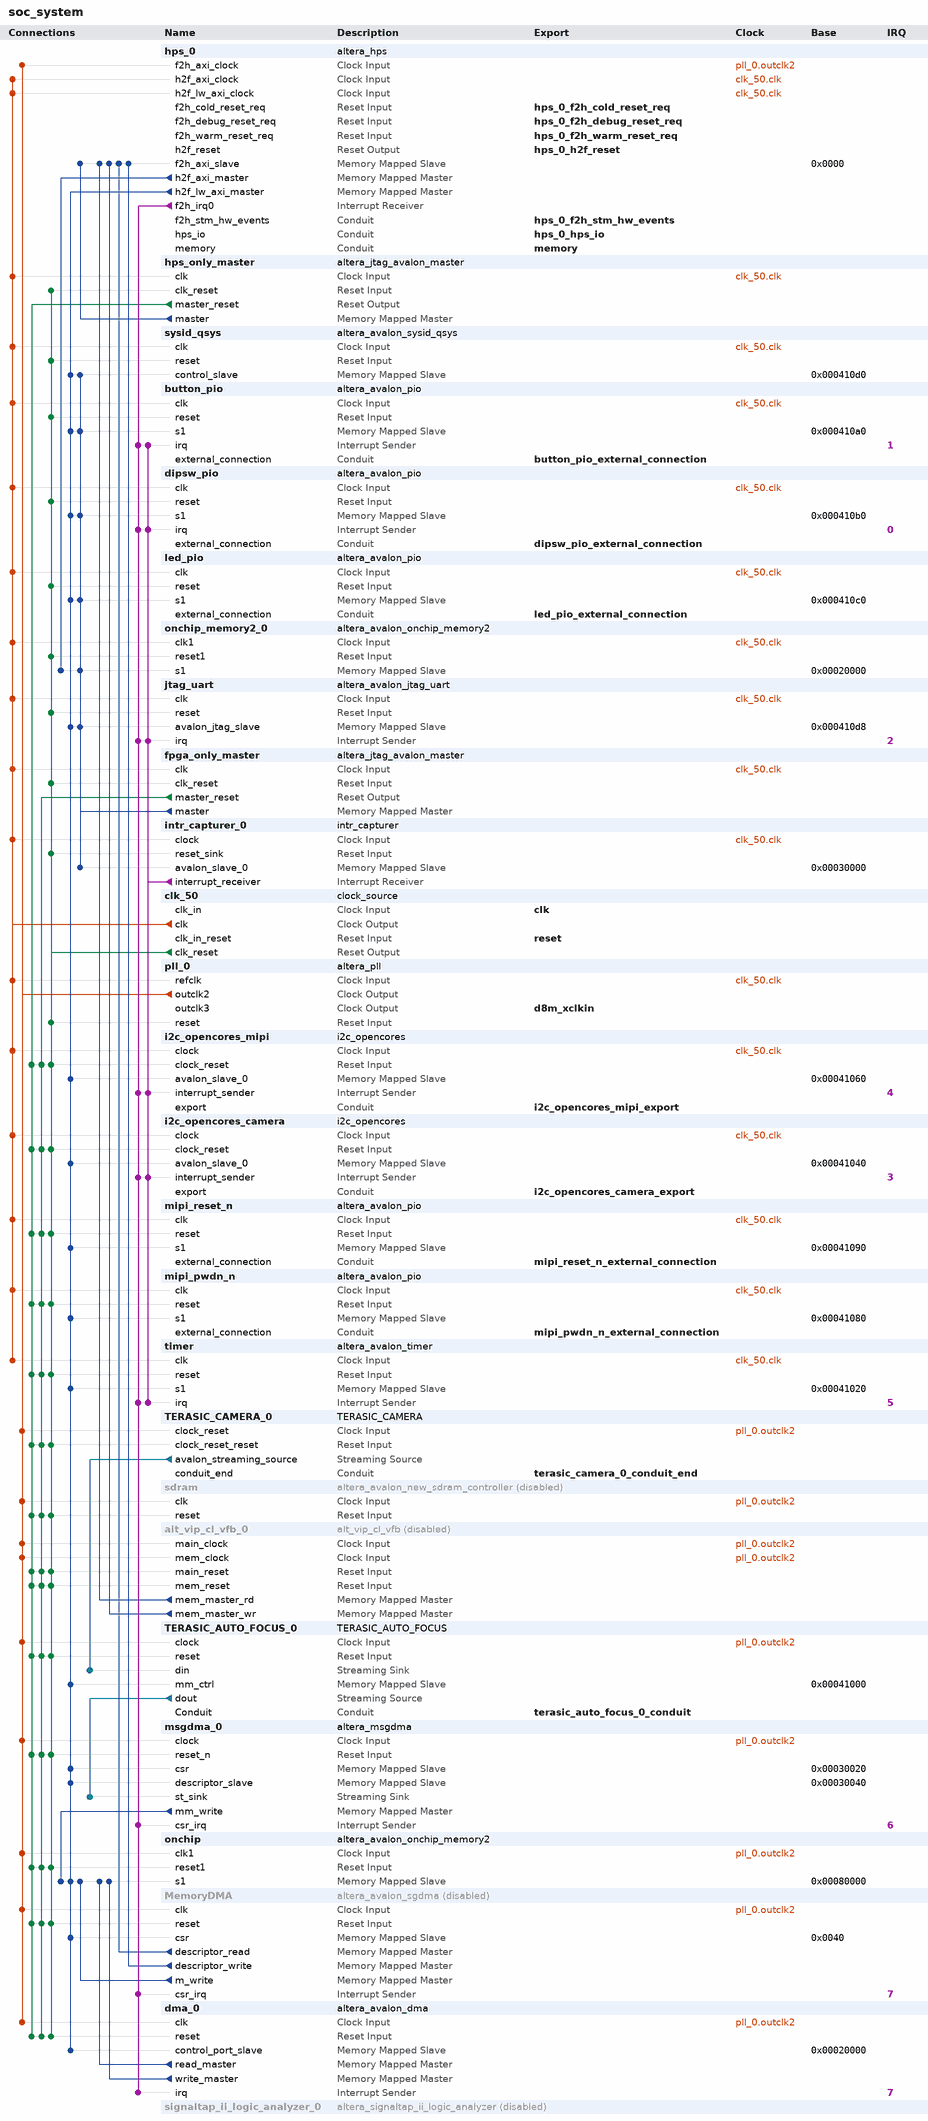
[diagram p0: system contents]
# Platform Designer (Qsys) system soc_system, Cyclone V 5CSEMA4U23C6
# Parameters at their usual value, and those the tool derives, are not listed.
package require -exact qsys 18.0
create_system soc_system
set_project_property DEVICE_FAMILY {Cyclone V}
set_project_property DEVICE 5CSEMA4U23C6

add_instance hps_0 altera_hps 18.0
set_instance_parameter_value hps_0 EMAC1_Mode RGMII
set_instance_parameter_value hps_0 EMAC1_PinMuxing {HPS I/O Set 0}
set_instance_parameter_value hps_0 F2SCLK_COLDRST_Enable true
set_instance_parameter_value hps_0 F2SCLK_DBGRST_Enable true
set_instance_parameter_value hps_0 F2SCLK_WARMRST_Enable true
set_instance_parameter_value hps_0 F2SINTERRUPT_Enable true
set_instance_parameter_value hps_0 F2S_Width 1
set_instance_parameter_value hps_0 FPGA_PERIPHERAL_OUTPUT_CLOCK_FREQ_EMAC0_GTX_CLK 100
set_instance_parameter_value hps_0 FPGA_PERIPHERAL_OUTPUT_CLOCK_FREQ_EMAC0_MD_CLK 100.0
set_instance_parameter_value hps_0 FPGA_PERIPHERAL_OUTPUT_CLOCK_FREQ_EMAC1_GTX_CLK 100
set_instance_parameter_value hps_0 FPGA_PERIPHERAL_OUTPUT_CLOCK_FREQ_EMAC1_MD_CLK 100.0
set_instance_parameter_value hps_0 HPS_PROTOCOL DDR3
set_instance_parameter_value hps_0 I2C0_Mode I2C
set_instance_parameter_value hps_0 I2C0_PinMuxing {HPS I/O Set 0}
set_instance_parameter_value hps_0 I2C1_Mode I2C
set_instance_parameter_value hps_0 I2C1_PinMuxing {HPS I/O Set 0}
set_instance_parameter_value hps_0 LWH2F_Enable true
set_instance_parameter_value hps_0 MEM_BANKADDR_WIDTH 3
set_instance_parameter_value hps_0 MEM_CLK_FREQ 400.0
set_instance_parameter_value hps_0 MEM_COL_ADDR_WIDTH 10
set_instance_parameter_value hps_0 MEM_DQ_WIDTH 32
set_instance_parameter_value hps_0 MEM_DRV_STR RZQ/6
set_instance_parameter_value hps_0 MEM_ROW_ADDR_WIDTH 13
set_instance_parameter_value hps_0 MEM_RTT_NOM RZQ/6
set_instance_parameter_value hps_0 MEM_RTT_WR {Dynamic ODT off}
set_instance_parameter_value hps_0 MEM_TCL 7
set_instance_parameter_value hps_0 MEM_TFAW_NS 37.5
set_instance_parameter_value hps_0 MEM_TRAS_NS 35.0
set_instance_parameter_value hps_0 MEM_TRCD_NS 13.75
set_instance_parameter_value hps_0 MEM_TRFC_NS 300.0
set_instance_parameter_value hps_0 MEM_TRP_NS 13.75
set_instance_parameter_value hps_0 MEM_VENDOR Other
set_instance_parameter_value hps_0 MEM_WTCL 7
set_instance_parameter_value hps_0 QSPI_Mode N/A
set_instance_parameter_value hps_0 QSPI_PinMuxing Unused
set_instance_parameter_value hps_0 REF_CLK_FREQ 25.0
set_instance_parameter_value hps_0 S2FCLK_USER2CLK 5
set_instance_parameter_value hps_0 S2F_Width 2
set_instance_parameter_value hps_0 SDIO_Mode {4-bit Data}
set_instance_parameter_value hps_0 SDIO_PinMuxing {HPS I/O Set 0}
set_instance_parameter_value hps_0 SPIM1_Mode {Single Slave Select}
set_instance_parameter_value hps_0 SPIM1_PinMuxing {HPS I/O Set 0}
set_instance_parameter_value hps_0 STM_Enable true
set_instance_parameter_value hps_0 TIMING_BOARD_AC_SKEW 0.02
set_instance_parameter_value hps_0 TIMING_BOARD_AC_TO_CK_SKEW 0.0
set_instance_parameter_value hps_0 TIMING_BOARD_DQ_TO_DQS_SKEW 0.0
set_instance_parameter_value hps_0 TIMING_BOARD_MAX_CK_DELAY 0.6
set_instance_parameter_value hps_0 TIMING_BOARD_MAX_DQS_DELAY 0.6
set_instance_parameter_value hps_0 TIMING_BOARD_SKEW_BETWEEN_DQS 0.02
set_instance_parameter_value hps_0 TIMING_BOARD_SKEW_CKDQS_DIMM_MAX 0.01
set_instance_parameter_value hps_0 TIMING_BOARD_SKEW_CKDQS_DIMM_MIN -0.01
set_instance_parameter_value hps_0 TIMING_BOARD_SKEW_WITHIN_DQS 0.02
set_instance_parameter_value hps_0 TIMING_TDH 125
set_instance_parameter_value hps_0 TIMING_TDQSCK 400
set_instance_parameter_value hps_0 TIMING_TDQSQ 120
set_instance_parameter_value hps_0 TIMING_TDS 50
set_instance_parameter_value hps_0 TIMING_TIH 250
set_instance_parameter_value hps_0 TIMING_TIS 175
set_instance_parameter_value hps_0 TIMING_TQSH 0.38
set_instance_parameter_value hps_0 UART0_Mode {No Flow Control}
set_instance_parameter_value hps_0 UART0_PinMuxing {HPS I/O Set 0}
set_instance_parameter_value hps_0 USB1_Mode SDR
set_instance_parameter_value hps_0 USB1_PinMuxing {HPS I/O Set 0}
set_instance_parameter_value hps_0 desired_cfg_clk_mhz 100.0
set_instance_parameter_value hps_0 desired_qspi_clk_mhz 370.0

add_instance hps_only_master altera_jtag_avalon_master 18.0

add_instance sysid_qsys altera_avalon_sysid_qsys 18.0
set_instance_parameter_value sysid_qsys id -1395322110

add_instance button_pio altera_avalon_pio 18.0
set_instance_parameter_value button_pio bitClearingEdgeCapReg true
set_instance_parameter_value button_pio captureEdge true
set_instance_parameter_value button_pio direction Input
set_instance_parameter_value button_pio edgeType FALLING
set_instance_parameter_value button_pio generateIRQ true
set_instance_parameter_value button_pio irqType EDGE
set_instance_parameter_value button_pio width 4

add_instance dipsw_pio altera_avalon_pio 18.0
set_instance_parameter_value dipsw_pio bitClearingEdgeCapReg true
set_instance_parameter_value dipsw_pio captureEdge true
set_instance_parameter_value dipsw_pio direction Input
set_instance_parameter_value dipsw_pio edgeType ANY
set_instance_parameter_value dipsw_pio generateIRQ true
set_instance_parameter_value dipsw_pio irqType EDGE
set_instance_parameter_value dipsw_pio width 4

add_instance led_pio altera_avalon_pio 18.0
set_instance_parameter_value led_pio direction Output
set_instance_parameter_value led_pio resetValue 255
set_instance_parameter_value led_pio width 8

add_instance onchip_memory2_0 altera_avalon_onchip_memory2 18.0
set_instance_parameter_value onchip_memory2_0 allowInSystemMemoryContentEditor true
set_instance_parameter_value onchip_memory2_0 dataWidth 64
set_instance_parameter_value onchip_memory2_0 dualPort false
set_instance_parameter_value onchip_memory2_0 initMemContent true
set_instance_parameter_value onchip_memory2_0 initializationFileName onchip_memory2_0
set_instance_parameter_value onchip_memory2_0 instanceID oc1
set_instance_parameter_value onchip_memory2_0 memorySize 4096

add_instance jtag_uart altera_avalon_jtag_uart 18.0
set_instance_parameter_value jtag_uart allowMultipleConnections true
set_instance_parameter_value jtag_uart simInteractiveOptions INTERACTIVE_ASCII_OUTPUT

add_instance fpga_only_master altera_jtag_avalon_master 18.0

add_instance intr_capturer_0 intr_capturer 100.99.98.97

add_instance clk_50 clock_source 18.0
set_instance_parameter_value clk_50 clockFrequency 50000000

add_instance pll_0 altera_pll 18.0
set_instance_parameter_value pll_0 gui_device_speed_grade 2
set_instance_parameter_value pll_0 gui_number_of_clocks 4
set_instance_parameter_value pll_0 gui_operation_mode normal
set_instance_parameter_value pll_0 gui_output_clock_frequency0 100.0
set_instance_parameter_value pll_0 gui_output_clock_frequency1 100.0
set_instance_parameter_value pll_0 gui_output_clock_frequency2 100.0
set_instance_parameter_value pll_0 gui_output_clock_frequency3 20.0
set_instance_parameter_value pll_0 gui_phase_shift1 -4000
set_instance_parameter_value pll_0 gui_pll_mode {Integer-N PLL}
set_instance_parameter_value pll_0 gui_reference_clock_frequency 50.0
set_instance_parameter_value pll_0 gui_use_locked false

add_instance i2c_opencores_mipi i2c_opencores 12.0

add_instance i2c_opencores_camera i2c_opencores 12.0

add_instance mipi_reset_n altera_avalon_pio 18.0
set_instance_parameter_value mipi_reset_n direction Output
set_instance_parameter_value mipi_reset_n width 1

add_instance mipi_pwdn_n altera_avalon_pio 18.0
set_instance_parameter_value mipi_pwdn_n direction Output
set_instance_parameter_value mipi_pwdn_n width 1

add_instance timer altera_avalon_timer 18.0
set_instance_parameter_value timer period 1
set_instance_parameter_value timer periodUnits MSEC

add_instance TERASIC_CAMERA_0 TERASIC_CAMERA 1.0

add_instance sdram altera_avalon_new_sdram_controller 18.0
set_instance_property sdram ENABLED false
set_instance_parameter_value sdram TAC 5.5
set_instance_parameter_value sdram TRCD 20.0
set_instance_parameter_value sdram TRP 20.0
set_instance_parameter_value sdram casLatency 3
set_instance_parameter_value sdram columnWidth 10
set_instance_parameter_value sdram dataWidth 32
set_instance_parameter_value sdram generateSimulationModel true
set_instance_parameter_value sdram model single_Micron_MT48LC4M32B2_7_chip
set_instance_parameter_value sdram numberOfBanks 4
set_instance_parameter_value sdram numberOfChipSelects 1
set_instance_parameter_value sdram powerUpDelay 100.0
set_instance_parameter_value sdram refreshPeriod 15.625
set_instance_parameter_value sdram rowWidth 13

add_instance alt_vip_cl_vfb_0 alt_vip_cl_vfb 18.0
set_instance_property alt_vip_cl_vfb_0 ENABLED false
set_instance_parameter_value alt_vip_cl_vfb_0 BURST_ALIGNMENT 0
set_instance_parameter_value alt_vip_cl_vfb_0 CLOCKS_ARE_SEPARATE 1
set_instance_parameter_value alt_vip_cl_vfb_0 DROP_FRAMES 1
set_instance_parameter_value alt_vip_cl_vfb_0 DROP_INVALID_FIELDS 1
set_instance_parameter_value alt_vip_cl_vfb_0 DROP_REPEAT_USER 0
set_instance_parameter_value alt_vip_cl_vfb_0 IS_FRAME_READER 0
set_instance_parameter_value alt_vip_cl_vfb_0 LINE_BASED_BUFFERING 0
set_instance_parameter_value alt_vip_cl_vfb_0 MAX_HEIGHT 480
set_instance_parameter_value alt_vip_cl_vfb_0 MAX_WIDTH 640
set_instance_parameter_value alt_vip_cl_vfb_0 MEM_BASE_ADDR -268435456
set_instance_parameter_value alt_vip_cl_vfb_0 MEM_BUFFER_OFFSET 16777216
set_instance_parameter_value alt_vip_cl_vfb_0 MEM_PORT_WIDTH 32
set_instance_parameter_value alt_vip_cl_vfb_0 PRIORITIZE_FMAX 0
set_instance_parameter_value alt_vip_cl_vfb_0 READER_RUNTIME_CONTROL 0
set_instance_parameter_value alt_vip_cl_vfb_0 READ_FIFO_DEPTH 512
set_instance_parameter_value alt_vip_cl_vfb_0 USER_PACKETS_MAX_STORAGE 1
set_instance_parameter_value alt_vip_cl_vfb_0 USE_BUFFER_OFFSET 0
set_instance_parameter_value alt_vip_cl_vfb_0 WRITE_BURST_TARGET 32
set_instance_parameter_value alt_vip_cl_vfb_0 WRITE_FIFO_DEPTH 512

add_instance TERASIC_AUTO_FOCUS_0 TERASIC_AUTO_FOCUS 1.0

add_instance msgdma_0 altera_msgdma 18.0
set_instance_parameter_value msgdma_0 BURST_ENABLE 0
set_instance_parameter_value msgdma_0 DATA_FIFO_DEPTH 32
set_instance_parameter_value msgdma_0 DATA_WIDTH 8
set_instance_parameter_value msgdma_0 DESCRIPTOR_FIFO_DEPTH 128
set_instance_parameter_value msgdma_0 ENHANCED_FEATURES 0
set_instance_parameter_value msgdma_0 ERROR_ENABLE 0
set_instance_parameter_value msgdma_0 MAX_BURST_COUNT 2
set_instance_parameter_value msgdma_0 MAX_BYTE 2097152
set_instance_parameter_value msgdma_0 MODE 2
set_instance_parameter_value msgdma_0 PACKET_ENABLE 1
set_instance_parameter_value msgdma_0 TRANSFER_TYPE {Aligned Accesses}

add_instance onchip altera_avalon_onchip_memory2 18.0
set_instance_parameter_value onchip allowInSystemMemoryContentEditor true
set_instance_parameter_value onchip dataWidth 32
set_instance_parameter_value onchip dualPort false
set_instance_parameter_value onchip initMemContent true
set_instance_parameter_value onchip initializationFileName onchip_mem.hex
set_instance_parameter_value onchip instanceID oc2
set_instance_parameter_value onchip memorySize 170000

add_instance MemoryDMA altera_avalon_sgdma 18.0
set_instance_property MemoryDMA ENABLED false
set_instance_parameter_value MemoryDMA enableBurstTransfers false
set_instance_parameter_value MemoryDMA enableUnalignedTransfers true
set_instance_parameter_value MemoryDMA readBlockDataWidth 8
set_instance_parameter_value MemoryDMA sinkErrorWidth 0
set_instance_parameter_value MemoryDMA sourceErrorWidth 0
set_instance_parameter_value MemoryDMA transferMode STREAM_TO_MEMORY
set_instance_parameter_value MemoryDMA writeBurstcountWidth 4

add_instance dma_0 altera_avalon_dma 18.0
set_instance_parameter_value dma_0 allowByteTransactions true
set_instance_parameter_value dma_0 allowDoubleWordTransactions true
set_instance_parameter_value dma_0 allowHalfWordTransactions true
set_instance_parameter_value dma_0 allowQuadWordTransactions true
set_instance_parameter_value dma_0 burstEnable false
set_instance_parameter_value dma_0 fifoDepth 32
set_instance_parameter_value dma_0 maxBurstSize 128
set_instance_parameter_value dma_0 minimumDmaTransactionRegisterWidth 13

add_instance signaltap_ii_logic_analyzer_0 altera_signaltap_ii_logic_analyzer 18.0
set_instance_property signaltap_ii_logic_analyzer_0 ENABLED false
set_instance_parameter_value signaltap_ii_logic_analyzer_0 device_family {Cyclone V}
set_instance_parameter_value signaltap_ii_logic_analyzer_0 gui_num_segments 2
set_instance_parameter_value signaltap_ii_logic_analyzer_0 gui_ram_type AUTO
set_instance_parameter_value signaltap_ii_logic_analyzer_0 gui_sq Continuous
set_instance_parameter_value signaltap_ii_logic_analyzer_0 gui_trigger_out_enabled false
set_instance_parameter_value signaltap_ii_logic_analyzer_0 gui_use_segmented false
set_instance_parameter_value signaltap_ii_logic_analyzer_0 sld_counter_pipeline 0
set_instance_parameter_value signaltap_ii_logic_analyzer_0 sld_data_bits 32
set_instance_parameter_value signaltap_ii_logic_analyzer_0 sld_enable_advanced_trigger 0
set_instance_parameter_value signaltap_ii_logic_analyzer_0 sld_incremental_routing 0
set_instance_parameter_value signaltap_ii_logic_analyzer_0 sld_node_crc_bits 32
set_instance_parameter_value signaltap_ii_logic_analyzer_0 sld_node_info 806383104
set_instance_parameter_value signaltap_ii_logic_analyzer_0 sld_pipeline_factor 0
set_instance_parameter_value signaltap_ii_logic_analyzer_0 sld_ram_pipeline 0
set_instance_parameter_value signaltap_ii_logic_analyzer_0 sld_sample_depth 128
set_instance_parameter_value signaltap_ii_logic_analyzer_0 sld_storage_qualifier_gap_record 0
set_instance_parameter_value signaltap_ii_logic_analyzer_0 sld_trigger_bits 1
set_instance_parameter_value signaltap_ii_logic_analyzer_0 sld_trigger_in_enabled 0
set_instance_parameter_value signaltap_ii_logic_analyzer_0 sld_trigger_level 1
set_instance_parameter_value signaltap_ii_logic_analyzer_0 sld_trigger_level_pipeline 1
set_instance_parameter_value signaltap_ii_logic_analyzer_0 sld_trigger_pipeline 0

# connections
add_connection clk_50.clk button_pio.clk clock
add_connection clk_50.clk dipsw_pio.clk clock
add_connection clk_50.clk fpga_only_master.clk clock
add_connection clk_50.clk hps_0.h2f_axi_clock clock
add_connection clk_50.clk hps_0.h2f_lw_axi_clock clock
add_connection clk_50.clk hps_only_master.clk clock
add_connection clk_50.clk i2c_opencores_camera.clock clock
add_connection clk_50.clk i2c_opencores_mipi.clock clock
add_connection clk_50.clk intr_capturer_0.clock clock
add_connection clk_50.clk jtag_uart.clk clock
add_connection clk_50.clk led_pio.clk clock
add_connection clk_50.clk mipi_pwdn_n.clk clock
add_connection clk_50.clk mipi_reset_n.clk clock
add_connection clk_50.clk onchip_memory2_0.clk1 clock
add_connection clk_50.clk pll_0.refclk clock
add_connection clk_50.clk sysid_qsys.clk clock
add_connection clk_50.clk timer.clk clock
add_connection pll_0.outclk2 alt_vip_cl_vfb_0.main_clock clock
add_connection pll_0.outclk2 alt_vip_cl_vfb_0.mem_clock clock
add_connection pll_0.outclk2 dma_0.clk clock
add_connection pll_0.outclk2 hps_0.f2h_axi_clock clock
add_connection pll_0.outclk2 MemoryDMA.clk clock
add_connection pll_0.outclk2 msgdma_0.clock clock
add_connection pll_0.outclk2 onchip.clk1 clock
add_connection pll_0.outclk2 sdram.clk clock
add_connection pll_0.outclk2 TERASIC_AUTO_FOCUS_0.clock clock
add_connection pll_0.outclk2 TERASIC_CAMERA_0.clock_reset clock
add_connection clk_50.clk_reset alt_vip_cl_vfb_0.main_reset reset
add_connection clk_50.clk_reset alt_vip_cl_vfb_0.mem_reset reset
add_connection clk_50.clk_reset button_pio.reset reset
add_connection clk_50.clk_reset dipsw_pio.reset reset
add_connection clk_50.clk_reset dma_0.reset reset
add_connection clk_50.clk_reset fpga_only_master.clk_reset reset
add_connection clk_50.clk_reset hps_only_master.clk_reset reset
add_connection clk_50.clk_reset i2c_opencores_camera.clock_reset reset
add_connection clk_50.clk_reset i2c_opencores_mipi.clock_reset reset
add_connection clk_50.clk_reset intr_capturer_0.reset_sink reset
add_connection clk_50.clk_reset jtag_uart.reset reset
add_connection clk_50.clk_reset led_pio.reset reset
add_connection clk_50.clk_reset MemoryDMA.reset reset
add_connection clk_50.clk_reset mipi_pwdn_n.reset reset
add_connection clk_50.clk_reset mipi_reset_n.reset reset
add_connection clk_50.clk_reset msgdma_0.reset_n reset
add_connection clk_50.clk_reset onchip.reset1 reset
add_connection clk_50.clk_reset onchip_memory2_0.reset1 reset
add_connection clk_50.clk_reset pll_0.reset reset
add_connection clk_50.clk_reset sdram.reset reset
add_connection clk_50.clk_reset sysid_qsys.reset reset
add_connection clk_50.clk_reset TERASIC_AUTO_FOCUS_0.reset reset
add_connection clk_50.clk_reset TERASIC_CAMERA_0.clock_reset_reset reset
add_connection clk_50.clk_reset timer.reset reset
add_connection fpga_only_master.master_reset alt_vip_cl_vfb_0.main_reset reset
add_connection fpga_only_master.master_reset alt_vip_cl_vfb_0.mem_reset reset
add_connection fpga_only_master.master_reset dma_0.reset reset
add_connection fpga_only_master.master_reset i2c_opencores_camera.clock_reset reset
add_connection fpga_only_master.master_reset i2c_opencores_mipi.clock_reset reset
add_connection fpga_only_master.master_reset MemoryDMA.reset reset
add_connection fpga_only_master.master_reset mipi_pwdn_n.reset reset
add_connection fpga_only_master.master_reset mipi_reset_n.reset reset
add_connection fpga_only_master.master_reset msgdma_0.reset_n reset
add_connection fpga_only_master.master_reset onchip.reset1 reset
add_connection fpga_only_master.master_reset sdram.reset reset
add_connection fpga_only_master.master_reset TERASIC_AUTO_FOCUS_0.reset reset
add_connection fpga_only_master.master_reset TERASIC_CAMERA_0.clock_reset_reset reset
add_connection fpga_only_master.master_reset timer.reset reset
add_connection hps_only_master.master_reset alt_vip_cl_vfb_0.main_reset reset
add_connection hps_only_master.master_reset alt_vip_cl_vfb_0.mem_reset reset
add_connection hps_only_master.master_reset dma_0.reset reset
add_connection hps_only_master.master_reset i2c_opencores_camera.clock_reset reset
add_connection hps_only_master.master_reset i2c_opencores_mipi.clock_reset reset
add_connection hps_only_master.master_reset MemoryDMA.reset reset
add_connection hps_only_master.master_reset mipi_pwdn_n.reset reset
add_connection hps_only_master.master_reset mipi_reset_n.reset reset
add_connection hps_only_master.master_reset msgdma_0.reset_n reset
add_connection hps_only_master.master_reset onchip.reset1 reset
add_connection hps_only_master.master_reset sdram.reset reset
add_connection hps_only_master.master_reset TERASIC_AUTO_FOCUS_0.reset reset
add_connection hps_only_master.master_reset TERASIC_CAMERA_0.clock_reset_reset reset
add_connection hps_only_master.master_reset timer.reset reset
add_connection alt_vip_cl_vfb_0.mem_master_rd hps_0.f2h_axi_slave avalon
set_connection_parameter_value alt_vip_cl_vfb_0.mem_master_rd/hps_0.f2h_axi_slave baseAddress 0x0000
add_connection alt_vip_cl_vfb_0.mem_master_wr hps_0.f2h_axi_slave avalon
set_connection_parameter_value alt_vip_cl_vfb_0.mem_master_wr/hps_0.f2h_axi_slave baseAddress 0x0000
add_connection dma_0.read_master onchip.s1 avalon
set_connection_parameter_value dma_0.read_master/onchip.s1 baseAddress 0x00080000
add_connection dma_0.write_master onchip.s1 avalon
set_connection_parameter_value dma_0.write_master/onchip.s1 baseAddress 0x00080000
add_connection fpga_only_master.master button_pio.s1 avalon
set_connection_parameter_value fpga_only_master.master/button_pio.s1 baseAddress 0x000410a0
add_connection fpga_only_master.master dipsw_pio.s1 avalon
set_connection_parameter_value fpga_only_master.master/dipsw_pio.s1 baseAddress 0x000410b0
add_connection fpga_only_master.master intr_capturer_0.avalon_slave_0 avalon
set_connection_parameter_value fpga_only_master.master/intr_capturer_0.avalon_slave_0 baseAddress 0x00030000
add_connection fpga_only_master.master jtag_uart.avalon_jtag_slave avalon
set_connection_parameter_value fpga_only_master.master/jtag_uart.avalon_jtag_slave baseAddress 0x000410d8
add_connection fpga_only_master.master led_pio.s1 avalon
set_connection_parameter_value fpga_only_master.master/led_pio.s1 baseAddress 0x000410c0
add_connection fpga_only_master.master onchip_memory2_0.s1 avalon
set_connection_parameter_value fpga_only_master.master/onchip_memory2_0.s1 baseAddress 0x00020000
add_connection fpga_only_master.master sysid_qsys.control_slave avalon
set_connection_parameter_value fpga_only_master.master/sysid_qsys.control_slave baseAddress 0x000410d0
add_connection hps_0.h2f_axi_master onchip_memory2_0.s1 avalon
set_connection_parameter_value hps_0.h2f_axi_master/onchip_memory2_0.s1 baseAddress 0x00020000
add_connection hps_0.h2f_lw_axi_master button_pio.s1 avalon
set_connection_parameter_value hps_0.h2f_lw_axi_master/button_pio.s1 baseAddress 0x000410a0
add_connection hps_0.h2f_lw_axi_master dipsw_pio.s1 avalon
set_connection_parameter_value hps_0.h2f_lw_axi_master/dipsw_pio.s1 baseAddress 0x000410b0
add_connection hps_0.h2f_lw_axi_master dma_0.control_port_slave avalon
set_connection_parameter_value hps_0.h2f_lw_axi_master/dma_0.control_port_slave baseAddress 0x00020000
add_connection hps_0.h2f_lw_axi_master i2c_opencores_camera.avalon_slave_0 avalon
set_connection_parameter_value hps_0.h2f_lw_axi_master/i2c_opencores_camera.avalon_slave_0 baseAddress 0x00041040
add_connection hps_0.h2f_lw_axi_master i2c_opencores_mipi.avalon_slave_0 avalon
set_connection_parameter_value hps_0.h2f_lw_axi_master/i2c_opencores_mipi.avalon_slave_0 baseAddress 0x00041060
add_connection hps_0.h2f_lw_axi_master jtag_uart.avalon_jtag_slave avalon
set_connection_parameter_value hps_0.h2f_lw_axi_master/jtag_uart.avalon_jtag_slave baseAddress 0x000410d8
add_connection hps_0.h2f_lw_axi_master led_pio.s1 avalon
set_connection_parameter_value hps_0.h2f_lw_axi_master/led_pio.s1 baseAddress 0x000410c0
add_connection hps_0.h2f_lw_axi_master MemoryDMA.csr avalon
set_connection_parameter_value hps_0.h2f_lw_axi_master/MemoryDMA.csr baseAddress 0x0040
add_connection hps_0.h2f_lw_axi_master mipi_pwdn_n.s1 avalon
set_connection_parameter_value hps_0.h2f_lw_axi_master/mipi_pwdn_n.s1 baseAddress 0x00041080
add_connection hps_0.h2f_lw_axi_master mipi_reset_n.s1 avalon
set_connection_parameter_value hps_0.h2f_lw_axi_master/mipi_reset_n.s1 baseAddress 0x00041090
add_connection hps_0.h2f_lw_axi_master msgdma_0.csr avalon
set_connection_parameter_value hps_0.h2f_lw_axi_master/msgdma_0.csr baseAddress 0x00030020
add_connection hps_0.h2f_lw_axi_master msgdma_0.descriptor_slave avalon
set_connection_parameter_value hps_0.h2f_lw_axi_master/msgdma_0.descriptor_slave baseAddress 0x00030040
add_connection hps_0.h2f_lw_axi_master onchip.s1 avalon
set_connection_parameter_value hps_0.h2f_lw_axi_master/onchip.s1 baseAddress 0x00080000
add_connection hps_0.h2f_lw_axi_master sysid_qsys.control_slave avalon
set_connection_parameter_value hps_0.h2f_lw_axi_master/sysid_qsys.control_slave baseAddress 0x000410d0
add_connection hps_0.h2f_lw_axi_master TERASIC_AUTO_FOCUS_0.mm_ctrl avalon
set_connection_parameter_value hps_0.h2f_lw_axi_master/TERASIC_AUTO_FOCUS_0.mm_ctrl baseAddress 0x00041000
add_connection hps_0.h2f_lw_axi_master timer.s1 avalon
set_connection_parameter_value hps_0.h2f_lw_axi_master/timer.s1 baseAddress 0x00041020
add_connection hps_only_master.master hps_0.f2h_axi_slave avalon
set_connection_parameter_value hps_only_master.master/hps_0.f2h_axi_slave baseAddress 0x0000
add_connection MemoryDMA.descriptor_read hps_0.f2h_axi_slave avalon
set_connection_parameter_value MemoryDMA.descriptor_read/hps_0.f2h_axi_slave baseAddress 0x0000
add_connection MemoryDMA.descriptor_write hps_0.f2h_axi_slave avalon
set_connection_parameter_value MemoryDMA.descriptor_write/hps_0.f2h_axi_slave baseAddress 0x0000
add_connection MemoryDMA.m_write onchip.s1 avalon
set_connection_parameter_value MemoryDMA.m_write/onchip.s1 baseAddress 0x00080000
add_connection msgdma_0.mm_write onchip.s1 avalon
set_connection_parameter_value msgdma_0.mm_write/onchip.s1 baseAddress 0x00080000
add_connection TERASIC_AUTO_FOCUS_0.dout msgdma_0.st_sink avalon_streaming
add_connection TERASIC_CAMERA_0.avalon_streaming_source TERASIC_AUTO_FOCUS_0.din avalon_streaming
add_connection hps_0.f2h_irq0 button_pio.irq interrupt
set_connection_parameter_value hps_0.f2h_irq0/button_pio.irq irqNumber 1
add_connection hps_0.f2h_irq0 dipsw_pio.irq interrupt
set_connection_parameter_value hps_0.f2h_irq0/dipsw_pio.irq irqNumber 0
add_connection hps_0.f2h_irq0 dma_0.irq interrupt
set_connection_parameter_value hps_0.f2h_irq0/dma_0.irq irqNumber 7
add_connection hps_0.f2h_irq0 i2c_opencores_camera.interrupt_sender interrupt
set_connection_parameter_value hps_0.f2h_irq0/i2c_opencores_camera.interrupt_sender irqNumber 3
add_connection hps_0.f2h_irq0 i2c_opencores_mipi.interrupt_sender interrupt
set_connection_parameter_value hps_0.f2h_irq0/i2c_opencores_mipi.interrupt_sender irqNumber 4
add_connection hps_0.f2h_irq0 jtag_uart.irq interrupt
set_connection_parameter_value hps_0.f2h_irq0/jtag_uart.irq irqNumber 2
add_connection hps_0.f2h_irq0 MemoryDMA.csr_irq interrupt
set_connection_parameter_value hps_0.f2h_irq0/MemoryDMA.csr_irq irqNumber 7
add_connection hps_0.f2h_irq0 msgdma_0.csr_irq interrupt
set_connection_parameter_value hps_0.f2h_irq0/msgdma_0.csr_irq irqNumber 6
add_connection hps_0.f2h_irq0 timer.irq interrupt
set_connection_parameter_value hps_0.f2h_irq0/timer.irq irqNumber 5
add_connection intr_capturer_0.interrupt_receiver button_pio.irq interrupt
set_connection_parameter_value intr_capturer_0.interrupt_receiver/button_pio.irq irqNumber 1
add_connection intr_capturer_0.interrupt_receiver dipsw_pio.irq interrupt
set_connection_parameter_value intr_capturer_0.interrupt_receiver/dipsw_pio.irq irqNumber 0
add_connection intr_capturer_0.interrupt_receiver i2c_opencores_camera.interrupt_sender interrupt
set_connection_parameter_value intr_capturer_0.interrupt_receiver/i2c_opencores_camera.interrupt_sender irqNumber 3
add_connection intr_capturer_0.interrupt_receiver i2c_opencores_mipi.interrupt_sender interrupt
set_connection_parameter_value intr_capturer_0.interrupt_receiver/i2c_opencores_mipi.interrupt_sender irqNumber 4
add_connection intr_capturer_0.interrupt_receiver jtag_uart.irq interrupt
set_connection_parameter_value intr_capturer_0.interrupt_receiver/jtag_uart.irq irqNumber 2
add_connection intr_capturer_0.interrupt_receiver timer.irq interrupt
set_connection_parameter_value intr_capturer_0.interrupt_receiver/timer.irq irqNumber 5

# exported interfaces
add_interface button_pio_external_connection conduit end
set_interface_property button_pio_external_connection EXPORT_OF button_pio.external_connection
add_interface clk clock sink
set_interface_property clk EXPORT_OF clk_50.clk_in
add_interface d8m_xclkin clock source
set_interface_property d8m_xclkin EXPORT_OF pll_0.outclk3
add_interface dipsw_pio_external_connection conduit end
set_interface_property dipsw_pio_external_connection EXPORT_OF dipsw_pio.external_connection
add_interface hps_0_f2h_cold_reset_req reset sink
set_interface_property hps_0_f2h_cold_reset_req EXPORT_OF hps_0.f2h_cold_reset_req
add_interface hps_0_f2h_debug_reset_req reset sink
set_interface_property hps_0_f2h_debug_reset_req EXPORT_OF hps_0.f2h_debug_reset_req
add_interface hps_0_f2h_stm_hw_events conduit end
set_interface_property hps_0_f2h_stm_hw_events EXPORT_OF hps_0.f2h_stm_hw_events
add_interface hps_0_f2h_warm_reset_req reset sink
set_interface_property hps_0_f2h_warm_reset_req EXPORT_OF hps_0.f2h_warm_reset_req
add_interface hps_0_h2f_reset reset source
set_interface_property hps_0_h2f_reset EXPORT_OF hps_0.h2f_reset
add_interface hps_0_hps_io conduit end
set_interface_property hps_0_hps_io EXPORT_OF hps_0.hps_io
add_interface i2c_opencores_camera_export conduit end
set_interface_property i2c_opencores_camera_export EXPORT_OF i2c_opencores_camera.export
add_interface i2c_opencores_mipi_export conduit end
set_interface_property i2c_opencores_mipi_export EXPORT_OF i2c_opencores_mipi.export
add_interface led_pio_external_connection conduit end
set_interface_property led_pio_external_connection EXPORT_OF led_pio.external_connection
add_interface memory conduit end
set_interface_property memory EXPORT_OF hps_0.memory
add_interface mipi_pwdn_n_external_connection conduit end
set_interface_property mipi_pwdn_n_external_connection EXPORT_OF mipi_pwdn_n.external_connection
add_interface mipi_reset_n_external_connection conduit end
set_interface_property mipi_reset_n_external_connection EXPORT_OF mipi_reset_n.external_connection
add_interface reset reset sink
set_interface_property reset EXPORT_OF clk_50.clk_in_reset
add_interface terasic_auto_focus_0_conduit conduit end
set_interface_property terasic_auto_focus_0_conduit EXPORT_OF TERASIC_AUTO_FOCUS_0.Conduit
add_interface terasic_camera_0_conduit_end conduit end
set_interface_property terasic_camera_0_conduit_end EXPORT_OF TERASIC_CAMERA_0.conduit_end

set_interconnect_requirement {$system} qsys_mm.clockCrossingAdapter HANDSHAKE
set_interconnect_requirement {$system} qsys_mm.maxAdditionalLatency 1

save_system soc_system.qsys
